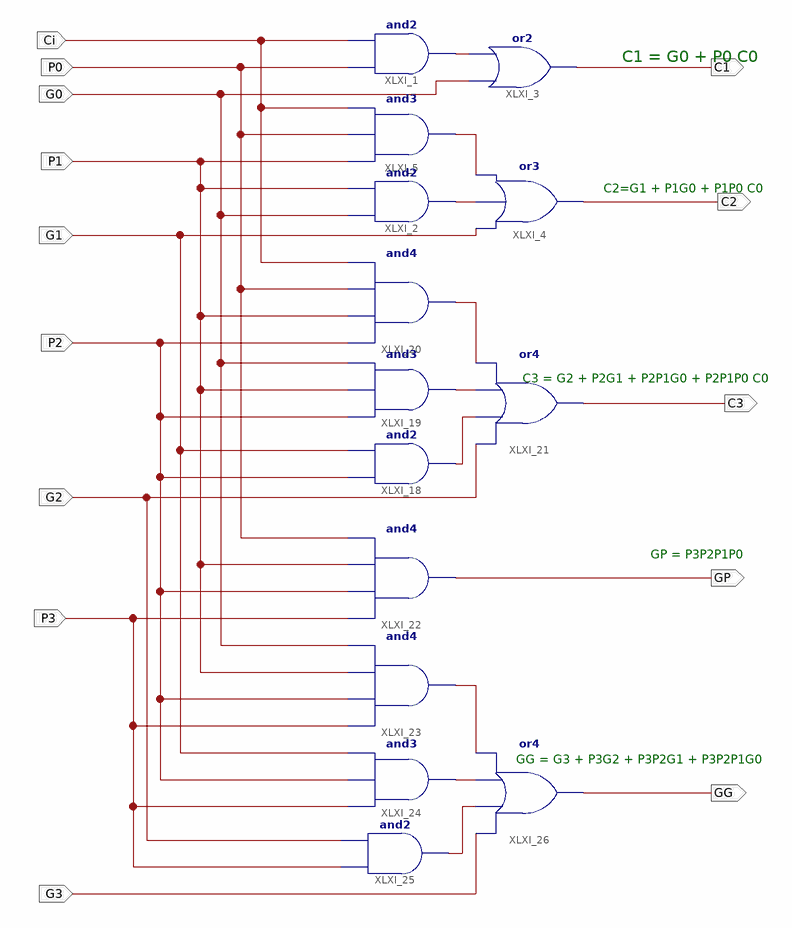
[diagram p0: schematic sheet 1]
// Xilinx ISE schematic CLA.sch (spartan3) as structural Verilog: 14 symbols, 14 ports
module CLA (
  input  G3,
  input  P3,
  input  G2,
  input  G0,
  input  P2,
  input  G1,
  input  P1,
  input  P0,
  input  Ci,
  output GP,
  output C3,
  output C2,
  output C1,
  output GG
);

  wire XLXN_3, XLXN_36, XLXN_59, XLXN_100, XLXN_105, XLXN_108, XLXN_163, XLXN_164, XLXN_165;

  or XLXI_3 (C1, G0, XLXN_3);
  and XLXI_1 (XLXN_3, P0, Ci);
  and XLXI_5 (XLXN_36, P1, P0, Ci);
  and XLXI_2 (XLXN_59, G0, P1);
  or XLXI_4 (C2, G1, XLXN_59, XLXN_36);
  and XLXI_20 (XLXN_100, P2, P1, P0, Ci);
  and XLXI_19 (XLXN_105, P2, P1, G0);
  and XLXI_18 (XLXN_108, P2, G1);
  and XLXI_22 (GP, P3, P2, P1, P0);
  and XLXI_23 (XLXN_163, P3, P2, P1, G0);
  and XLXI_24 (XLXN_164, P3, P2, G1);
  and XLXI_25 (XLXN_165, P3, G2);
  or XLXI_21 (C3, G2, XLXN_108, XLXN_105, XLXN_100);
  or XLXI_26 (GG, G3, XLXN_165, XLXN_164, XLXN_163);

  // Notes on the sheet:
  //   C1 = G0 + P0 C0
  //   C2=G1 + P1G0 + P1P0 C0
  //   C3 = G2 + P2G1 + P2P1G0 + P2P1P0 C0
  //   GP = P3P2P1P0
  //   GG = G3 + P3G2 + P3P2G1 + P3P2P1G0
endmodule
